# Altium project AD9959.PrjPcb
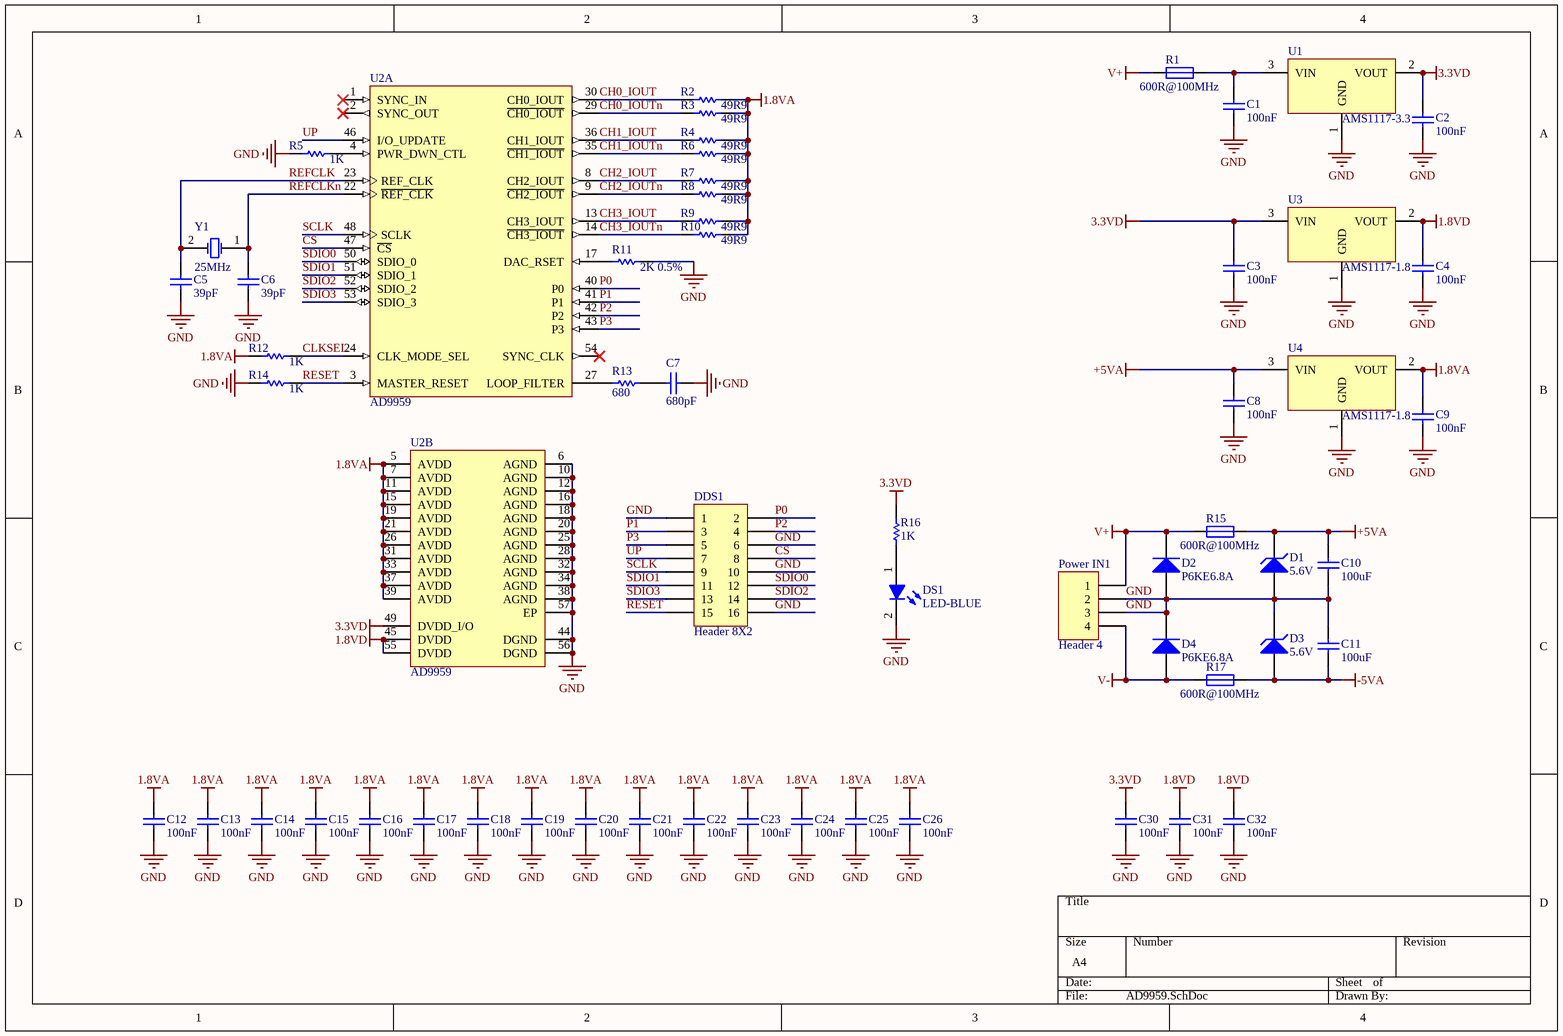
[diagram p0: AD9959.SchDoc]
2 sheets, 106 parts. Net scope: global (net labels, ports and power ports of the same name join across sheets).
Board file: AD9959.PcbDoc
Sheets:
  AD9959.SchDoc
  AD9959_OUTPUT.SchDoc

## Sheet AD9959.SchDoc
size A4

### Parts
C1  100nF  [CAPC0603(1608)55_M]
C2  100nF  [CAPC0603(1608)55_M]
C3  100nF  [CAPC0603(1608)55_M]
C4  100nF  [CAPC0603(1608)55_M]
C5  39pF  [CAPC0603(1608)55_M]
C6  39pF  [CAPC0603(1608)55_M]
C7  680pF  [CAPC0603(1608)55_M]
C8  100nF  [CAPC0603(1608)55_M]
C9  100nF  [CAPC0603(1608)55_M]
C10  100uF  [CAPC3225]
C11  100uF  [CAPC3225]
C12  100nF  [CAPC0603(1608)55_M]
C13  100nF  [CAPC0603(1608)55_M]
C14  100nF  [CAPC0603(1608)55_M]
C15  100nF  [CAPC0603(1608)55_M]
C16  100nF  [CAPC0603(1608)55_M]
C17  100nF  [CAPC0603(1608)55_M]
C18  100nF  [CAPC0603(1608)55_M]
C19  100nF  [CAPC0603(1608)55_M]
C20  100nF  [CAPC0603(1608)55_M]
C21  100nF  [CAPC0603(1608)55_M]
C22  100nF  [CAPC0603(1608)55_M]
C23  100nF  [CAPC0603(1608)55_M]
C24  100nF  [CAPC0603(1608)55_M]
C25  100nF  [CAPC0603(1608)55_M]
C26  100nF  [CAPC0603(1608)55_M]
C30  100nF  [CAPC0603(1608)55_M]
C31  100nF  [CAPC0603(1608)55_M]
C32  100nF  [CAPC0603(1608)55_M]
D1  5.6V  [LL34]
D2  P6KE6.8A  [DO-214AC]
D3  5.6V  [LL34]
D4  P6KE6.8A  [DO-214AC]
DDS1  Header 8X2  [HEADER8X2]
DS1  LED-BLUE  [0603LED_BLUE_V]
Power_IN1  Header 4  [3.96-4]
R1  600R@100MHz  [RESC1206(3216)_M]
R2  49R9  [RESC0603(1608)_M]
R3  49R9  [RESC0603(1608)_M]
R4  49R9  [RESC0603(1608)_M]
R5  1K  [RESC0603(1608)_M]
R6  49R9  [RESC0603(1608)_M]
R7  49R9  [RESC0603(1608)_M]
R8  49R9  [RESC0603(1608)_M]
R9  49R9  [RESC0603(1608)_M]
R10  49R9  [RESC0603(1608)_M]
R11  2K 0.5%  [RESC0603(1608)_M]
R12  1K  [RESC0603(1608)_M]
R13  680  [RESC0603(1608)_M]
R14  1K  [RESC0603(1608)_M]
R15  600R@100MHz  [RESC1206(3216)_M]
R16  1K  [RESC0603(1608)_M]
R17  600R@100MHz  [RESC1206(3216)_M]
U1  AMS1117-3.3  [SOT-223_M]
U2  AD9959  [QFN56]  (parts A,B of 2)
U3  AMS1117-1.8  [SOT-223_M]
U4  AMS1117-1.8  [SOT-223_M]
Y1  25MHz  [HC-49S]

### Nets
1.8VA: C9.2 C12.2 C13.2 C14.2 C15.2 C16.2 C17.2 C18.2 C19.2 C20.2 C21.2 C22.2 C23.2 C24.2 C25.2 C26.2 R2.2 R3.2 R4.2 R6.2 R7.2 R8.2 R9.2 R10.2 R12.1 U2.5(AVDD) U2.7(AVDD) U2.11(AVDD) U2.15(AVDD) U2.19(AVDD) U2.21(AVDD) U2.26(AVDD) U2.31(AVDD) U2.33(AVDD) U2.37(AVDD) U2.39(AVDD) U4.2(VOUT)
1.8VD: C4.2 C31.2 C32.2 U2.45(DVDD) U2.55(DVDD) U3.2(VOUT)
3.3VD: C2.2 C3.2 C30.2 R16.2 U1.2(VOUT) U2.49(DVDD_I/O) U3.3(VIN)
+5VA: C8.2 C10.2 D1.2(K) R15.2 U4.3(VIN)
-5VA: C11.2 D3.1(A) R17.2
GND: C1.1 C2.1 C3.1 C4.1 C5.1 C6.1 C7.2 C8.1 C9.1 C10.1 C11.1 C12.1 C13.1 C14.1 C15.1 C16.1 C17.1 C18.1 C19.1 C20.1 C21.1 C22.1 C23.1 C24.1 C25.1 C26.1 C30.1 C31.1 C32.1 D1.1(A) D2.2(A) D3.2(K) D4.1(K) DDS1.1 DDS1.6 DDS1.10 DDS1.16 DS1.2(K) Power_IN1.2 Power_IN1.3 R5.1 R11.2 R14.1 U1.1(GND) U2.6(AGND) U2.10(AGND) U2.12(AGND) U2.16(AGND) U2.18(AGND) U2.20(AGND) U2.25(AGND) U2.28(AGND) U2.32(AGND) U2.34(AGND) U2.38(AGND) U2.44(DGND) U2.56(DGND) U2.57(EP) U3.1(GND) U4.1(GND)
V+: D2.1(K) Power_IN1.1 R1.1 R15.1
V-: D4.2(A) Power_IN1.4 R17.1
CH0_IOUT: R2.1 U2.30(CH0_IOUT)
CH0_IOUTn: R3.1 U2.29(~{CH0_IOUT})
CH1_IOUT: R4.1 U2.36(CH1_IOUT)
CH1_IOUTn: R6.1 U2.35(~{CH1_IOUT})
CH2_IOUT: R7.1 U2.8(CH2_IOUT)
CH2_IOUTn: R8.1 U2.9(~{CH2_IOUT})
CH3_IOUT: R9.1 U2.13(CH3_IOUT)
CH3_IOUTn: R10.1 U2.14(~{CH3_IOUT})
CLKSEL: R12.2 U2.24(CLK_MODE_SEL)
CS: DDS1.8 U2.47(~{CS})
P0: DDS1.2 U2.40(P0)
P1: DDS1.3 U2.41(P1)
P2: DDS1.4 U2.42(P2)
P3: DDS1.5 U2.43(P3)
REFCLK: C5.2 U2.23(REF_CLK) Y1.2(OSC2)
REFCLKn: C6.2 U2.22(~{REF_CLK}) Y1.1(OSC1)
RESET: DDS1.15 R14.2 U2.3(MASTER_RESET)
SCLK: DDS1.9 U2.48(SCLK)
SDIO0: DDS1.12 U2.50(SDIO_0)
SDIO1: DDS1.11 U2.51(SDIO_1)
SDIO2: DDS1.14 U2.52(SDIO_2)
SDIO3: DDS1.13 U2.53(SDIO_3)
UP: DDS1.7 U2.46(I/O_UPDATE)
NetC1_2: C1.2 R1.2 U1.3(VIN)
NetC7_1: C7.1 R13.2
NetDS1_1: DS1.1(A) R16.1
NetR5_2: R5.2 U2.4(PWR_DWN_CTL)
NetR11_1: R11.1 U2.17(DAC_RSET)
NetR13_1: R13.1 U2.27(LOOP_FILTER)

Not connected (* = marked no-connect by the designer): U2 1(SYNC_IN)* 2(SYNC_OUT)* 54(SYNC_CLK)*

### Library data of the parts
C1-C26 C30-C32 = CAP
D1 D3 = D Zener: Zener Diode; Published: 8-Jun-2000; LatestRevisionDate: 17-Jul-2002; LatestRevisionNote: Re-released for DXP Platform.; PackageReference: DIODE-0.7; Publisher: Altium Limited; PackageDescription: Diode, Thru-Hole; 2 Leads; 0.7 in Pin Spacing
D2 D4 = Diode: pin to pad: 1>2 2>1
DDS1 = Header 8X2: Header, 8-Pin, Dual row; LatestRevisionDate: 17-Jul-2002; LatestRevisionNote: Re-released for DXP Platform.; Publisher: Altium Limited
Power_IN1 = Header 4: Header, 4-Pin; LatestRevisionDate: 17-Jul-2002; LatestRevisionNote: Re-released for DXP Platform.; Publisher: Altium Limited
R1 R15 R17 = Ferrite Bead: Manufacturer: Generic Components; Class: Passive; SubClass: Resistor; Value: 4K7; Published: 08/06/2000; Publisher: Altium Hobart Technology Centre
R2-R14 R16 = RES
U1 U3 U4 = AMS1117
Y1 = XTAL: Crystal Oscillator; Published: 8-Jun-2000; LatestRevisionDate: 17-Jul-2002; LatestRevisionNote: Re-released for DXP Platform.; PackageReference: R38; Publisher: Altium Limited; PackageDescription: Crystal, Thru-Hole; 2 Leads; Body 3.1 x 8.2 mm (Dia.xH)

## Sheet AD9959_OUTPUT.SchDoc
size A4
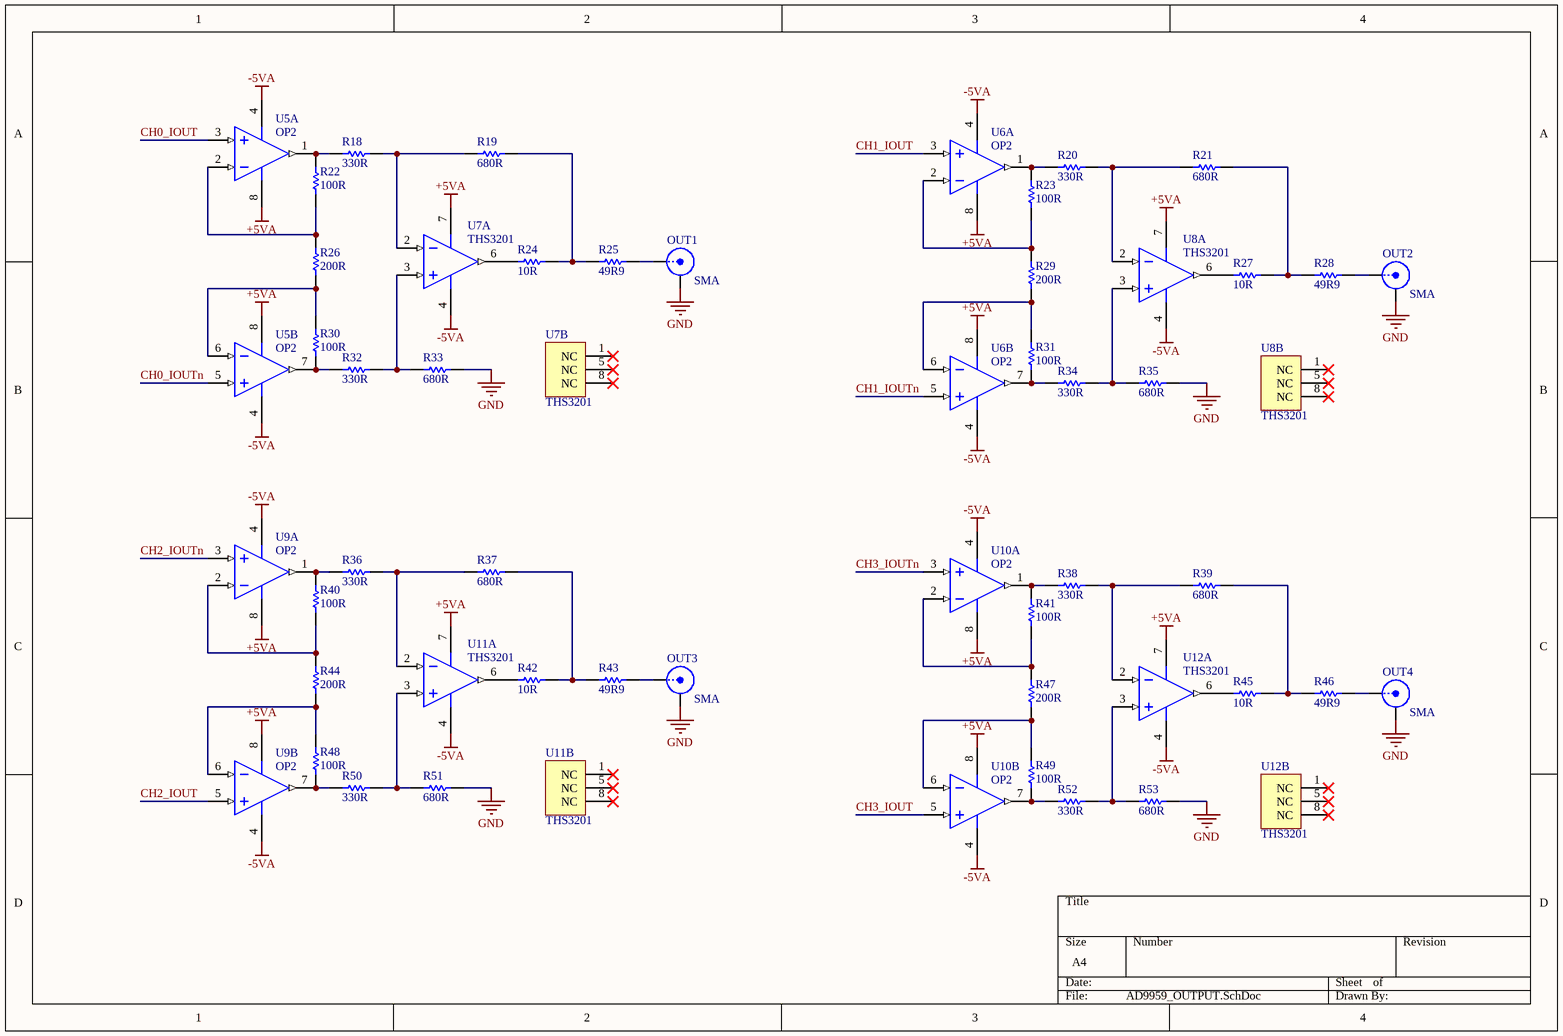
[diagram p1: AD9959_OUTPUT.SchDoc]

### Parts
OUT1  SMA  [SMA-V]
OUT2  SMA  [SMA-V]
OUT3  SMA  [SMA-V]
OUT4  SMA  [SMA-V]
R18  330R  [RESC0603(1608)_M]
R19  680R  [RESC0603(1608)_M]
R20  330R  [RESC0603(1608)_M]
R21  680R  [RESC0603(1608)_M]
R22  100R  [RESC0603(1608)_M]
R23  100R  [RESC0603(1608)_M]
R24  10R  [RESC0603(1608)_M]
R25  49R9  [RESC0603(1608)_M]
R26  200R  [RESC0603(1608)_M]
R27  10R  [RESC0603(1608)_M]
R28  49R9  [RESC0603(1608)_M]
R29  200R  [RESC0603(1608)_M]
R30  100R  [RESC0603(1608)_M]
R31  100R  [RESC0603(1608)_M]
R32  330R  [RESC0603(1608)_M]
R33  680R  [RESC0603(1608)_M]
R34  330R  [RESC0603(1608)_M]
R35  680R  [RESC0603(1608)_M]
R36  330R  [RESC0603(1608)_M]
R37  680R  [RESC0603(1608)_M]
R38  330R  [RESC0603(1608)_M]
R39  680R  [RESC0603(1608)_M]
R40  100R  [RESC0603(1608)_M]
R41  100R  [RESC0603(1608)_M]
R42  10R  [RESC0603(1608)_M]
R43  49R9  [RESC0603(1608)_M]
R44  200R  [RESC0603(1608)_M]
R45  10R  [RESC0603(1608)_M]
R46  49R9  [RESC0603(1608)_M]
R47  200R  [RESC0603(1608)_M]
R48  100R  [RESC0603(1608)_M]
R49  100R  [RESC0603(1608)_M]
R50  330R  [RESC0603(1608)_M]
R51  680R  [RESC0603(1608)_M]
R52  330R  [RESC0603(1608)_M]
R53  680R  [RESC0603(1608)_M]
U5  OP2  [SOIC8]  (parts A,B of 2)
U6  OP2  [SOIC8]  (parts A,B of 2)
U7  THS3201  [SOIC8]  (parts A,B of 2)
U8  THS3201  [SOIC8]  (parts A,B of 2)
U9  OP2  [SOIC8]  (parts A,B of 2)
U10  OP2  [SOIC8]  (parts A,B of 2)
U11  THS3201  [SOIC8]  (parts A,B of 2)
U12  THS3201  [SOIC8]  (parts A,B of 2)

### Nets
+5VA: U5.8(V+) U6.8(V+) U7.7(VS+) U8.7(VS+) U9.8(V+) U10.8(V+) U11.7(VS+) U12.7(VS+)
-5VA: U5.4(V-) U6.4(V-) U7.4(VS-) U8.4(VS-) U9.4(V-) U10.4(V-) U11.4(VS-) U12.4(VS-)
GND: OUT1.2(Y) OUT2.2(Y) OUT3.2(Y) OUT4.2(Y) R33.2 R35.2 R51.2 R53.2
CH0_IOUT: U5.3(IN_A+)
CH0_IOUTn: U5.5(IN_B+)
CH1_IOUT: U6.3(IN_A+)
CH1_IOUTn: U6.5(IN_B+)
CH2_IOUT: U9.5(IN_B+)
CH2_IOUTn: U9.3(IN_A+)
CH3_IOUT: U10.5(IN_B+)
CH3_IOUTn: U10.3(IN_A+)
NetOUT1_1: OUT1.1(X) R25.2
NetOUT2_1: OUT2.1(X) R28.2
NetOUT3_1: OUT3.1(X) R43.2
NetOUT4_1: OUT4.1(X) R46.2
NetR18_1: R18.1 R22.2 U5.1(OUT_A)
NetR18_2: R18.2 R19.1 U7.2(VIN-)
NetR19_2: R19.2 R24.2 R25.1
NetR20_1: R20.1 R23.2 U6.1(OUT_A)
NetR20_2: R20.2 R21.1 U8.2(VIN-)
NetR21_2: R21.2 R27.2 R28.1
NetR22_1: R22.1 R26.2 U5.2(IN_A-)
NetR23_1: R23.1 R29.2 U6.2(IN_A-)
NetR24_1: R24.1 U7.6(VOUT)
NetR26_1: R26.1 R30.2 U5.6(IN_B-)
NetR27_1: R27.1 U8.6(VOUT)
NetR29_1: R29.1 R31.2 U6.6(IN_B-)
NetR30_1: R30.1 R32.1 U5.7(OUT_B)
NetR31_1: R31.1 R34.1 U6.7(OUT_B)
NetR32_2: R32.2 R33.1 U7.3(VIN+)
NetR34_2: R34.2 R35.1 U8.3(VIN+)
NetR36_1: R36.1 R40.2 U9.1(OUT_A)
NetR36_2: R36.2 R37.1 U11.2(VIN-)
NetR37_2: R37.2 R42.2 R43.1
NetR38_1: R38.1 R41.2 U10.1(OUT_A)
NetR38_2: R38.2 R39.1 U12.2(VIN-)
NetR39_2: R39.2 R45.2 R46.1
NetR40_1: R40.1 R44.2 U9.2(IN_A-)
NetR41_1: R41.1 R47.2 U10.2(IN_A-)
NetR42_1: R42.1 U11.6(VOUT)
NetR44_1: R44.1 R48.2 U9.6(IN_B-)
NetR45_1: R45.1 U12.6(VOUT)
NetR47_1: R47.1 R49.2 U10.6(IN_B-)
NetR48_1: R48.1 R50.1 U9.7(OUT_B)
NetR49_1: R49.1 R52.1 U10.7(OUT_B)
NetR50_2: R50.2 R51.1 U11.3(VIN+)
NetR52_2: R52.2 R53.1 U12.3(VIN+)

Not connected (* = marked no-connect by the designer): U7 1(NC)* 5(NC)* 8(NC)*; U8 1(NC)* 5(NC)* 8(NC)*; U11 1(NC)* 5(NC)* 8(NC)*; U12 1(NC)* 5(NC)* 8(NC)*

### Library data of the parts
R18-R53 = RES
OUT1-OUT4 = SMA: LatestRevisionDate: 17-Jul-2002; LatestRevisionNote: Re-released for DXP Platform.; Publisher: Altium Limited

## Nets that join several sheets
+5VA: AD9959 (5 pins), AD9959_OUTPUT (8 pins)
-5VA: AD9959 (C11.2 D3.1 R17.2), AD9959_OUTPUT (8 pins)
GND: AD9959 (60 pins), AD9959_OUTPUT (8 pins)
CH0_IOUT: AD9959 (R2.1 U2.30), AD9959_OUTPUT (U5.3)
CH0_IOUTn: AD9959 (R3.1 U2.29), AD9959_OUTPUT (U5.5)
CH1_IOUT: AD9959 (R4.1 U2.36), AD9959_OUTPUT (U6.3)
CH1_IOUTn: AD9959 (R6.1 U2.35), AD9959_OUTPUT (U6.5)
CH2_IOUT: AD9959 (R7.1 U2.8), AD9959_OUTPUT (U9.5)
CH2_IOUTn: AD9959 (R8.1 U2.9), AD9959_OUTPUT (U9.3)
CH3_IOUT: AD9959 (R9.1 U2.13), AD9959_OUTPUT (U10.5)
CH3_IOUTn: AD9959 (R10.1 U2.14), AD9959_OUTPUT (U10.3)